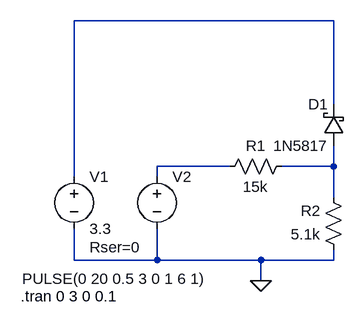
[diagram p0: schematic Input Diode Protection.asc]
Input Diode Protection.asc, the LTspice schematic file:
Version 4
SHEET 1 880 680
WIRE 176 -48 -224 -48
WIRE 176 80 176 -48
WIRE 16 176 -96 176
WIRE 176 176 176 144
WIRE 176 176 96 176
WIRE -224 192 -224 -48
WIRE -96 192 -96 176
WIRE 176 224 176 176
WIRE -224 320 -224 272
WIRE -96 320 -96 272
WIRE -96 320 -224 320
WIRE 64 320 -96 320
WIRE 176 320 176 304
WIRE 176 320 64 320
WIRE 64 352 64 320
FLAG 64 352 0
SYMBOL schottky 192 144 R180
WINDOW 0 24 64 Left 2
WINDOW 3 24 0 Left 2
SYMATTR InstName D1
SYMATTR Value 1N5817
SYMATTR Description Diode
SYMATTR Type diode
SYMBOL res 112 160 R90
WINDOW 0 0 56 VBottom 2
WINDOW 3 32 56 VTop 2
SYMATTR InstName R1
SYMATTR Value 15k
SYMBOL res 192 320 R180
WINDOW 0 36 76 Left 2
WINDOW 3 36 40 Left 2
SYMATTR InstName R2
SYMATTR Value 5.1k
SYMBOL voltage -224 176 R0
WINDOW 123 0 0 Left 0
WINDOW 39 24 124 Left 2
SYMATTR InstName V1
SYMATTR Value 3.3
SYMATTR SpiceLine Rser=0
SYMBOL voltage -96 176 R0
WINDOW 3 -208 173 Left 2
WINDOW 123 0 0 Left 0
WINDOW 39 0 0 Left 0
SYMATTR InstName V2
SYMATTR Value PULSE(0 20 0.5 3 0 1 6 1)
TEXT -306 376 Left 2 !.tran 0 3 0 0.1

The netlist it stands for:
* Input Diode Protection.asc
D1 N003 N001 1N5817
R1 N003 N002 15k
R2 0 N003 5.1k
V1 N001 0 3.3 Rser=0
V2 N002 0 PULSE(0 20 0.5 3 0 1 6 1)
.model D D
.lib standard.dio
.tran 0 3 0 0.1
.backanno
.end